# EAGLE design PCB-BI8-1x12SC3 (EAGLE 7.5.0)
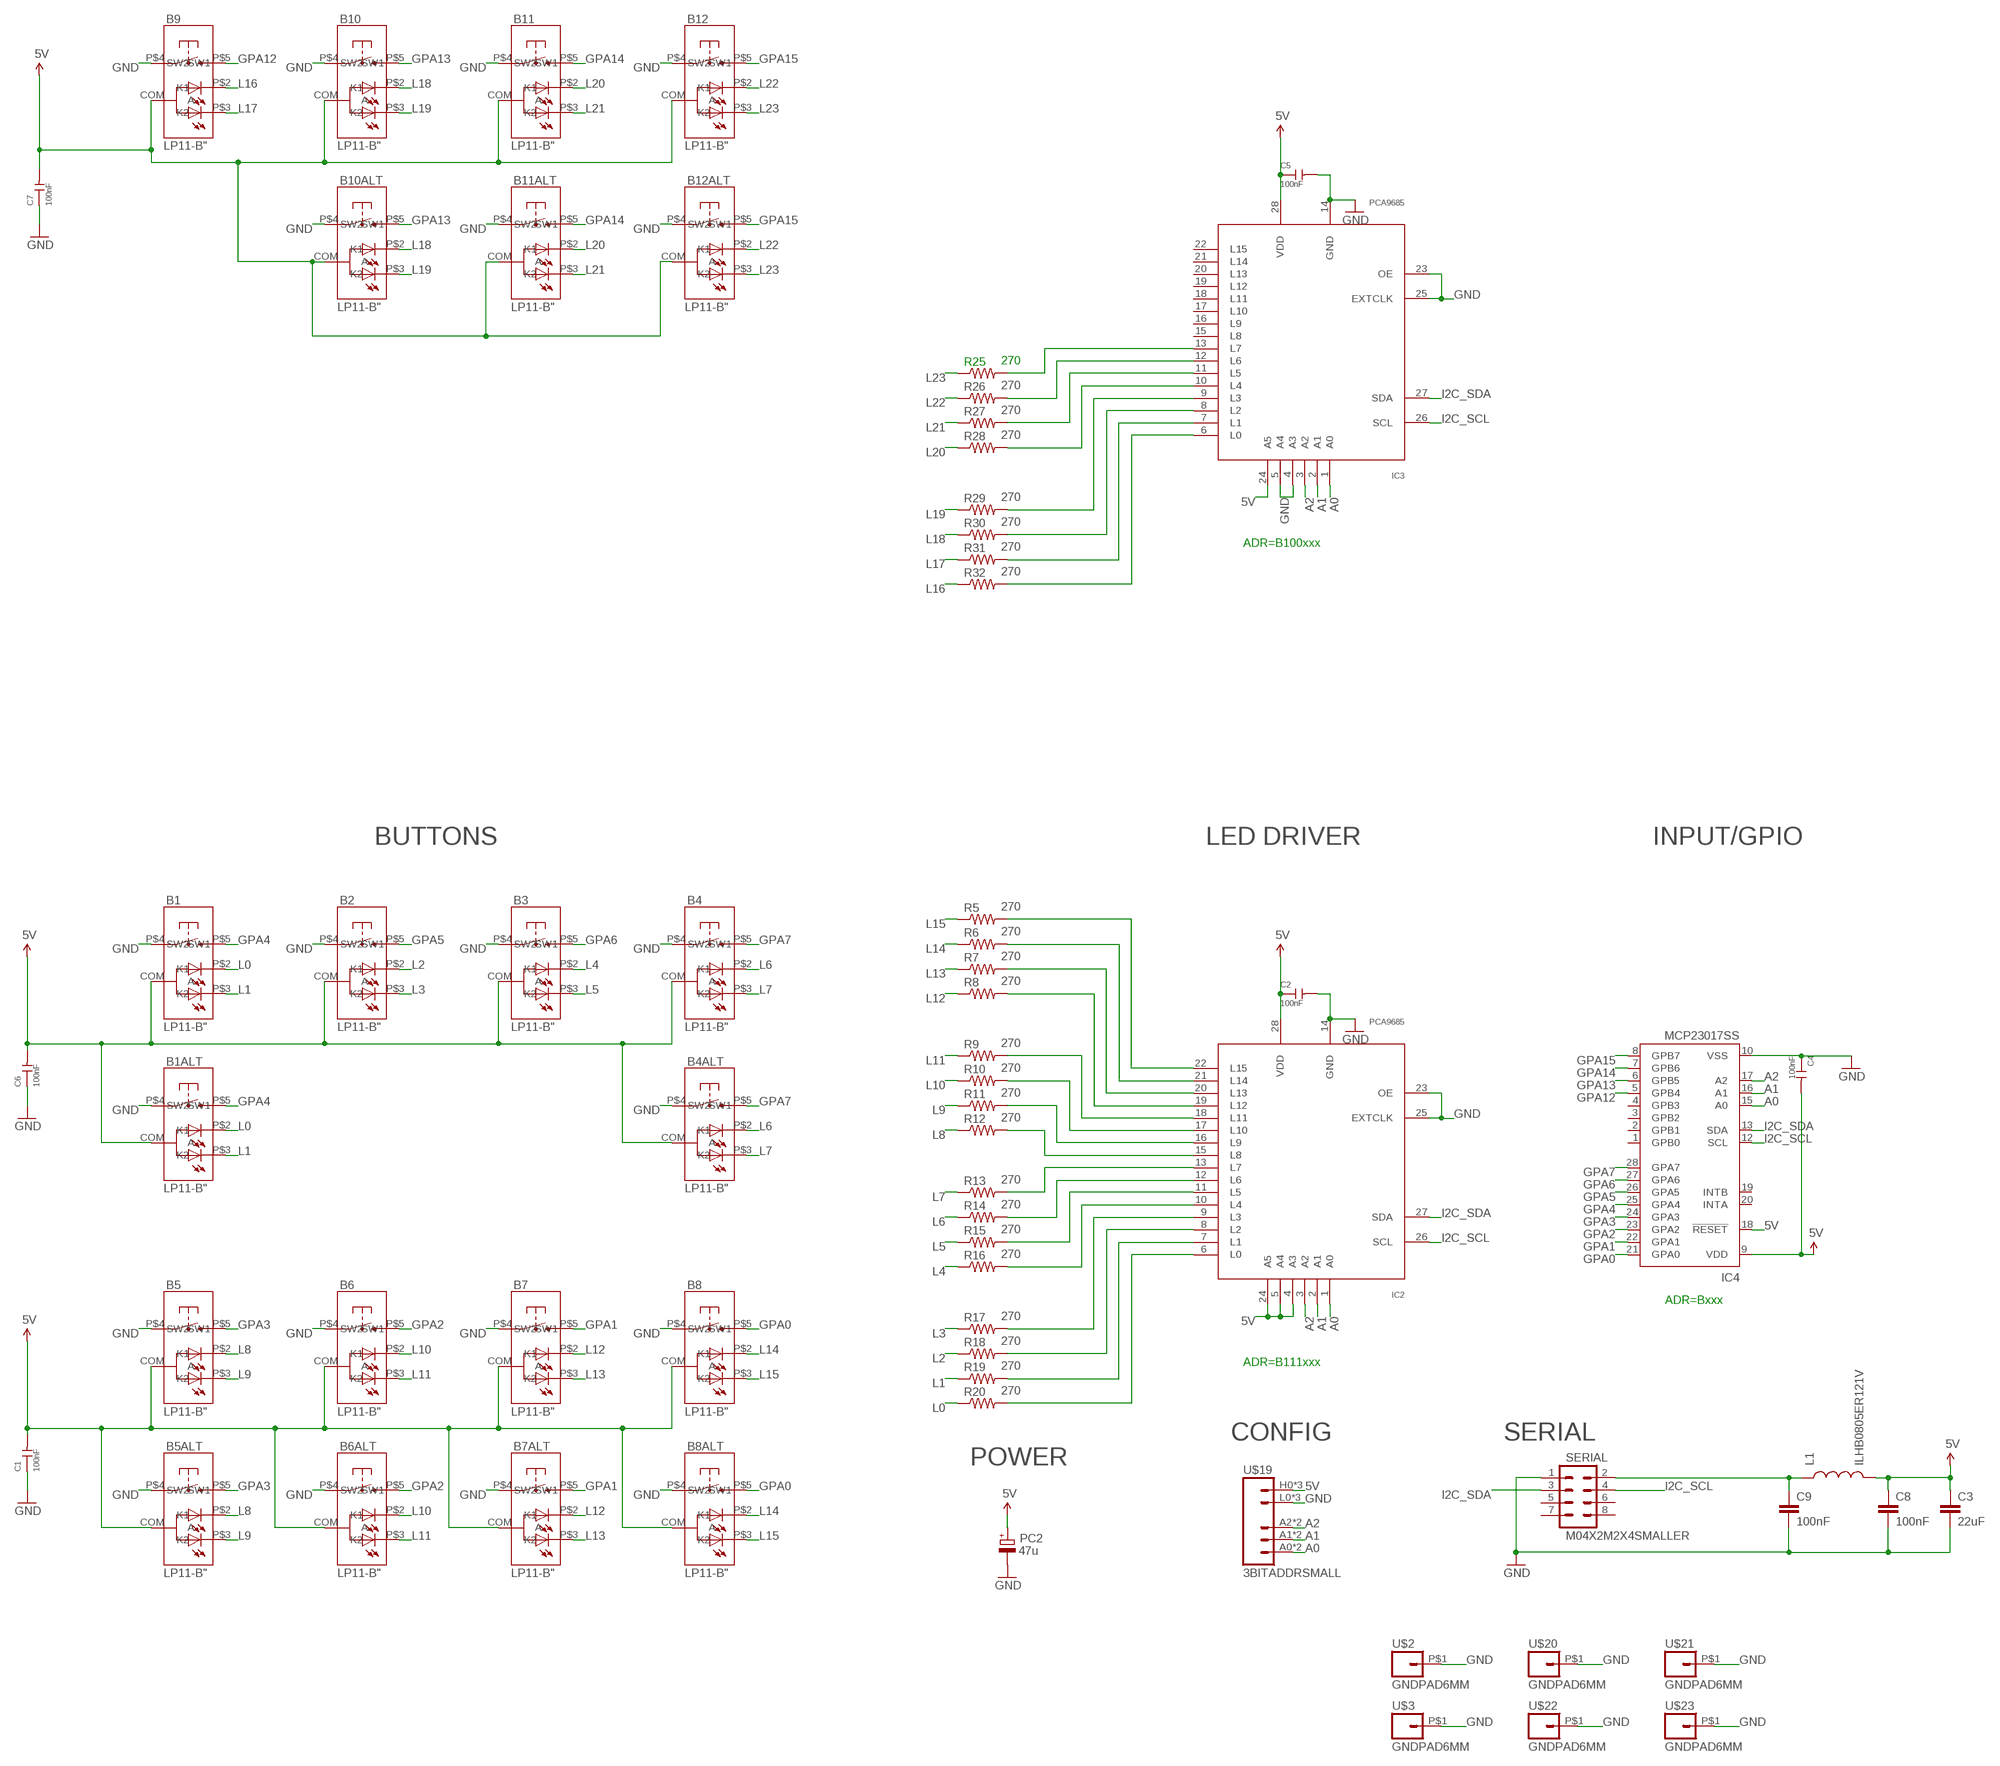
[diagram p0: schematic, sheet 1]

## Parts
B1  LP11-B"  [LP11]
B1ALT  LP11-B"  [LP11]
B2  LP11-B"  [LP11]
B3  LP11-B"  [LP11]
B4  LP11-B"  [LP11]
B4ALT  LP11-B"  [LP11]
B5  LP11-B"  [LP11]
B5ALT  LP11-B"  [LP11]
B6  LP11-B"  [LP11]
B6ALT  LP11-B"  [LP11]
B7  LP11-B"  [LP11]
B7ALT  LP11-B"  [LP11]
B8  LP11-B"  [LP11]
B8ALT  LP11-B"  [LP11]
B9  LP11-B"  [LP11]
B10  LP11-B"  [LP11]
B10ALT  LP11-B"  [LP11]
B11  LP11-B"  [LP11]
B11ALT  LP11-B"  [LP11]
B12  LP11-B"  [LP11]
B12ALT  LP11-B"  [LP11]
C1  100nF  CAP-0603  [C0603]
C2  100nF  CAP-0603  [C0603]
C3  22uF  CAP0805  [0805]
C4  100nF  CAP-0603  [C0603]
C5  100nF  CAP-0603  [C0603]
C6  100nF  CAP-0603  [C0603]
C7  100nF  CAP-0603  [C0603]
C8  100nF  CAP0603-CAP  [0603-CAP]
C9  100nF  CAP0603-CAP  [0603-CAP]
IC2  PCA9685  [TSSOP28]
IC3  PCA9685  [TSSOP28]
IC4  MCP23017SS  [SSOP28]
L1  ILHB0805ER121V  INDUCTOR0805  [0805]
PC2  47u  CPOL-EUD  [PANASONIC_D]
R5  270  RESISTOR0603-RES  [0603-RES]
R6  270  RESISTOR0603-RES  [0603-RES]
R7  270  RESISTOR0603-RES  [0603-RES]
R8  270  RESISTOR0603-RES  [0603-RES]
R9  270  RESISTOR0603-RES  [0603-RES]
R10  270  RESISTOR0603-RES  [0603-RES]
R11  270  RESISTOR0603-RES  [0603-RES]
R12  270  RESISTOR0603-RES  [0603-RES]
R13  270  RESISTOR0603-RES  [0603-RES]
R14  270  RESISTOR0603-RES  [0603-RES]
R15  270  RESISTOR0603-RES  [0603-RES]
R16  270  RESISTOR0603-RES  [0603-RES]
R17  270  RESISTOR0603-RES  [0603-RES]
R18  270  RESISTOR0603-RES  [0603-RES]
R19  270  RESISTOR0603-RES  [0603-RES]
R20  270  RESISTOR0603-RES  [0603-RES]
R25  270  RESISTOR0603-RES  [0603-RES]
R26  270  RESISTOR0603-RES  [0603-RES]
R27  270  RESISTOR0603-RES  [0603-RES]
R28  270  RESISTOR0603-RES  [0603-RES]
R29  270  RESISTOR0603-RES  [0603-RES]
R30  270  RESISTOR0603-RES  [0603-RES]
R31  270  RESISTOR0603-RES  [0603-RES]
R32  270  RESISTOR0603-RES  [0603-RES]
SERIAL  M04X2M2X4SMALLER  [M2X4SMALLER]
U$2  GNDPAD6MM  [3.2MMPAD6MM]
U$3  GNDPAD6MM  [3.2MMPAD6MM]
U$19  3BITADDRSMALL  [3BITADDR_SMALL]
U$20  GNDPAD6MM  [3.2MMPAD6MM]
U$21  GNDPAD6MM  [3.2MMPAD6MM]
U$22  GNDPAD6MM  [3.2MMPAD6MM]
U$23  GNDPAD6MM  [3.2MMPAD6MM]

## Nets
5V [Power]: B1.COM(A) B1ALT.COM(A) B2.COM(A) B3.COM(A) B4.COM(A) B4ALT.COM(A) B5.COM(A) B5ALT.COM(A) B6.COM(A) B6ALT.COM(A) B7.COM(A) B7ALT.COM(A) B8.COM(A) B8ALT.COM(A) B9.COM(A) B10.COM(A) B10ALT.COM(A) B11.COM(A) B11ALT.COM(A) B12.COM(A) B12ALT.COM(A) C1.2 C2.1 C3.1 C4.2 C5.1 C6.2 C7.2 C8.1 IC2.4(A3) IC2.5(A4) IC2.24(A5) IC2.28(VDD) IC3.24(A5) IC3.28(VDD) IC4.9(VDD) IC4.18(!RESET) L1.2 PC2.+ U$19.H0(VCC) U$19.H1(VCC) U$19.H2(VCC)
A0: IC2.1(A0) IC3.1(A0) IC4.15(A0) U$19.A0 U$19.AS0(A0)
A1: IC2.2(A1) IC3.2(A1) IC4.16(A1) U$19.A1 U$19.AS1(A1)
A2: IC2.3(A2) IC3.3(A2) IC4.17(A2) U$19.A2 U$19.AS2(A2)
GND [Power]: B1.P$4(SW1) B1ALT.P$4(SW1) B2.P$4(SW1) B3.P$4(SW1) B4.P$4(SW1) B4ALT.P$4(SW1) B5.P$4(SW1) B5ALT.P$4(SW1) B6.P$4(SW1) B6ALT.P$4(SW1) B7.P$4(SW1) B7ALT.P$4(SW1) B8.P$4(SW1) B8ALT.P$4(SW1) B9.P$4(SW1) B10.P$4(SW1) B10ALT.P$4(SW1) B11.P$4(SW1) B11ALT.P$4(SW1) B12.P$4(SW1) B12ALT.P$4(SW1) C1.1 C2.2 C3.2 C4.1 C5.2 C6.1 C7.1 C8.2 C9.2 IC2.14(GND) IC2.23(OE) IC2.25(EXTCLK) IC3.4(A3) IC3.5(A4) IC3.14(GND) IC3.23(OE) IC3.25(EXTCLK) IC4.10(VSS) PC2.- SERIAL.1 U$2.P$1 U$3.P$1 U$19.L0(GND) U$19.L1(GND) U$19.L2(GND) U$20.P$1 U$21.P$1 U$22.P$1 U$23.P$1
GPA0: B8.P$5(SW2) B8ALT.P$5(SW2) IC4.21(GPA0)
GPA1: B7.P$5(SW2) B7ALT.P$5(SW2) IC4.22(GPA1)
GPA2: B6.P$5(SW2) B6ALT.P$5(SW2) IC4.23(GPA2)
GPA3: B5.P$5(SW2) B5ALT.P$5(SW2) IC4.24(GPA3)
GPA4: B1.P$5(SW2) B1ALT.P$5(SW2) IC4.25(GPA4)
GPA5: B2.P$5(SW2) IC4.26(GPA5)
GPA6: B3.P$5(SW2) IC4.27(GPA6)
GPA7: B4.P$5(SW2) B4ALT.P$5(SW2) IC4.28(GPA7)
GPA12: B9.P$5(SW2) IC4.5(GPB4)
GPA13: B10.P$5(SW2) B10ALT.P$5(SW2) IC4.6(GPB5)
GPA14: B11.P$5(SW2) B11ALT.P$5(SW2) IC4.7(GPB6)
GPA15: B12.P$5(SW2) B12ALT.P$5(SW2) IC4.8(GPB7)
I2C_SCL: IC2.26(SCL) IC3.26(SCL) IC4.12(SCL) SERIAL.4
I2C_SDA: IC2.27(SDA) IC3.27(SDA) IC4.13(SDA) SERIAL.3
L0: B1.P$2(K1) B1ALT.P$2(K1) R20.1
L1: B1.P$3(K2) B1ALT.P$3(K2) R19.1
L2: B2.P$2(K1) R18.1
L3: B2.P$3(K2) R17.1
L4: B3.P$2(K1) R16.1
L5: B3.P$3(K2) R15.1
L6: B4.P$2(K1) B4ALT.P$2(K1) R14.1
L7: B4.P$3(K2) B4ALT.P$3(K2) R13.1
L8: B5.P$2(K1) B5ALT.P$2(K1) R12.1
L9: B5.P$3(K2) B5ALT.P$3(K2) R11.1
L10: B6.P$2(K1) B6ALT.P$2(K1) R10.1
L11: B6.P$3(K2) B6ALT.P$3(K2) R9.1
L12: B7.P$2(K1) B7ALT.P$2(K1) R8.1
L13: B7.P$3(K2) B7ALT.P$3(K2) R7.1
L14: B8.P$2(K1) B8ALT.P$2(K1) R6.1
L15: B8.P$3(K2) B8ALT.P$3(K2) R5.1
L16: B9.P$2(K1) R32.1
L17: B9.P$3(K2) R31.1
L18: B10.P$2(K1) B10ALT.P$2(K1) R30.1
L19: B10.P$3(K2) B10ALT.P$3(K2) R29.1
L20: B11.P$2(K1) B11ALT.P$2(K1) R28.1
L21: B11.P$3(K2) B11ALT.P$3(K2) R27.1
L22: B12.P$2(K1) B12ALT.P$2(K1) R26.1
L23: B12.P$3(K2) B12ALT.P$3(K2) R25.1
N$1: IC3.13(L7) R25.2
N$2: IC3.12(L6) R26.2
N$3: IC3.11(L5) R27.2
N$4: IC2.13(L7) R13.2
N$5: IC2.12(L6) R14.2
N$6: IC3.10(L4) R28.2
N$7: IC2.11(L5) R15.2
N$8: IC3.9(L3) R29.2
N$9: IC2.10(L4) R16.2
N$10: IC2.9(L3) R17.2
N$11: IC2.8(L2) R18.2
N$12: IC2.7(L1) R19.2
N$13: IC3.8(L2) R30.2
N$14: IC3.7(L1) R31.2
N$15: IC3.6(L0) R32.2
N$16 [Power]: C9.1 L1.1 SERIAL.2
N$19: IC2.6(L0) R20.2
N$20: IC2.15(L8) R12.2
N$21: IC2.16(L9) R11.2
N$22: IC2.17(L10) R10.2
N$23: IC2.18(L11) R9.2
N$24: IC2.19(L12) R8.2
N$25: IC2.20(L13) R7.2
N$26: IC2.21(L14) R6.2
N$27: IC2.22(L15) R5.2
Unconnected: IC3.15(L8) IC3.16(L9) IC3.17(L10) IC3.18(L11) IC3.19(L12) IC3.20(L13) IC3.21(L14) IC3.22(L15) IC4.1(GPB0) IC4.2(GPB1) IC4.3(GPB2) IC4.4(GPB3) IC4.19(INTB) IC4.20(INTA) SERIAL.5 SERIAL.6 SERIAL.7 SERIAL.8

## Notes on the sheet
- ADR=B100xxx
- BUTTONS | LED DRIVER | INPUT/GPIO
- ADR=Bxxx
- ADR=B111xxx
- CONFIG | SERIAL
- POWER

## Library data of the parts
B1 B1ALT B2-B4 B4ALT B5 B5ALT B6 B6ALT B7 B7ALT B8 B8ALT B9 B10 B10ALT B11 B11ALT B12 B12ALT = SKAARHOJ:LP11-B
C1 C2 C4-C7 = OPL:CAP: Ceramic Capacitors
C3 C8 C9 = SparkFun:CAP: Capacitor Standard 0603 ceramic capacitor, and 0.1" leaded capacitor.
IC2 IC3 = wsmith:PCA9685
IC4 = microchip:MCP23017: http://ww1.microchip.com/downloads/en/DeviceDoc/21952a.pdf Source: http://ww1.microchip.com/downloads/en/DeviceDoc/21952a.pdf; MF: MICROCHIP; MPN: MCP23017-E/SS; OC_FARNELL: 1467674; OC_NEWARK: 31K2960
L1 = SparkFun:INDUCTOR: Inductors Basic Inductor/Choke - 0603 and 1206. Footprints are not proven and vary greatly between part numbers.
PC2 = rcl:CPOL-EU: POLARIZED CAPACITOR, European symbol
R5-R20 R25-R32 = SparkFun-Passives:RESISTOR: Resistor Basic schematic elements and footprints for 0603, 1206, and PTH resistors.
SERIAL = SKAARHOJ:M04X2
U$2 U$3 U$20-U$23 = SKAARHOJ:GNDPAD
U$19 = SKAARHOJ:3BITADDR

## Net classes
0 default: width 0.152 mm, drill 0.406 mm, clearance 0.152 mm
1 Power: width 0.406 mm, drill 0.61 mm, clearance 0.152 mm

## Board
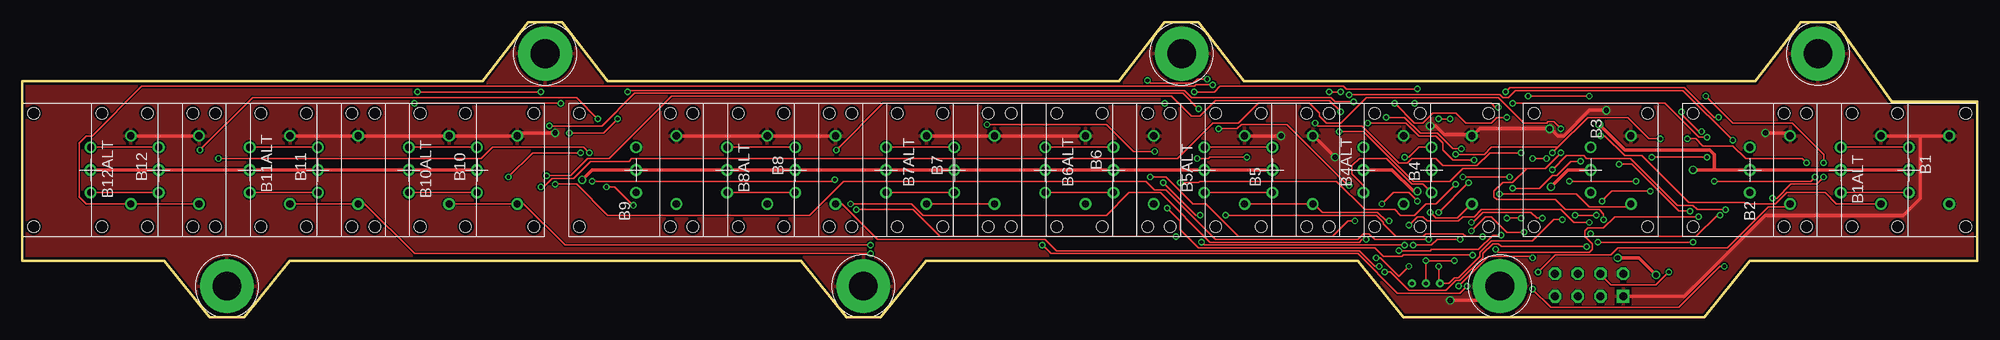
[diagram p1: board, top side]
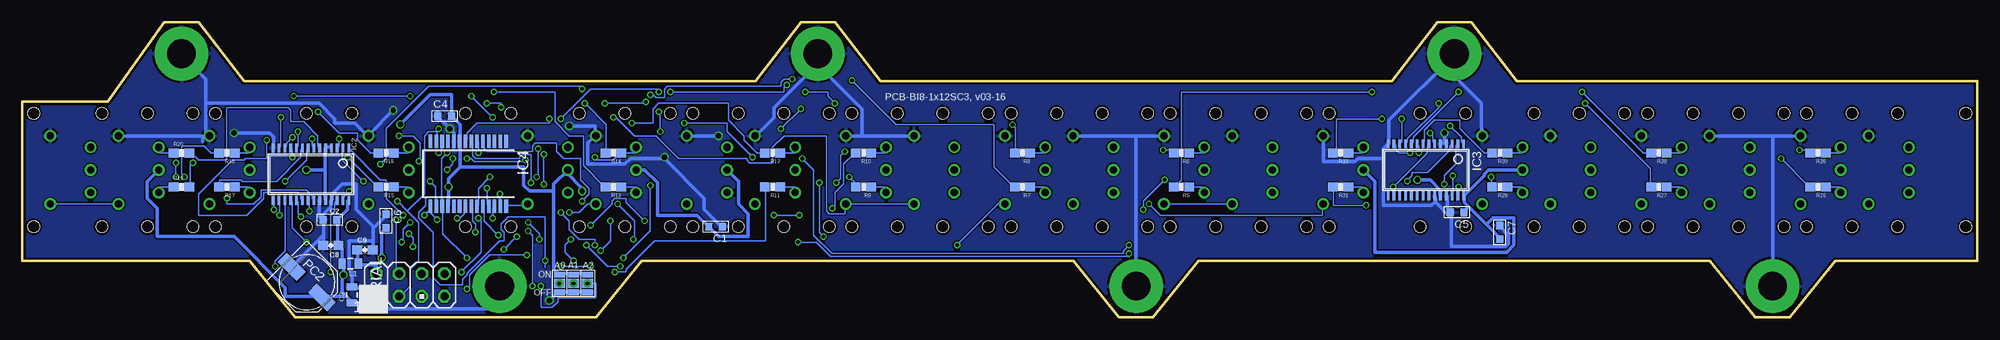
[diagram p2: board, bottom side, seen from below]

Size 218.44 x 33.02 mm. Coordinates in mm from the lower left corner, seen from the top.
Outline: 0,26.42 51.44,26.42 56.52,33.02 60.33,33.02 65.41,26.42 122.56,26.42 127.64,33.02 131.44,33.02 136.53,26.42 193.68,26.42 198.75,33.02 202.56,33.02 208.91,24.13 218.44,24.13 218.44,6.35 193.04,6.35 187.96,0 154.31,0 149.22,6.35 100.97,6.35 95.89,0 92.08,0 87,6.35 29.84,6.35 24.77,0 20.95,0 15.88,6.35 0,6.35 0,26.42
Copper layers (1*16): Top 0.035mm / dielectric 1.5mm / Bottom 0.035mm
Design rules "Fusion_eagle_rule_v1.1": minimum track width 6mil, minimum drill 12mil, track to track 6mil, track to pad 6mil, pad to pad 6mil, via to via 6mil, smd to smd 0mil, copper to edge 10mil, drill to drill 10mil, minimum pad ring 10mil, minimum via ring 6mil, stop-mask expansion 2mil, vias tented up to drill 100mil, thermal gap 10mil

### Footprints (pad centres in the part's own frame; a part is rotated, then mirrored left to right if it is on the bottom)
LP11 = drill 0.8: COM 0,0; P$2 0,2.54; P$3 0,-2.54; P$4 4.5,3.81; P$5 4.5,-3.81 | hole 1.3: -6.35,6.35; 6.35,6.35; 6.35,-6.35; -6.35,-6.35
C0603 = smd 0.889 x 0.889: 1 -0.762,0; 2 0.762,0
0805 = smd 0.8 x 1.2: 1 -0.9,0; 2 0.9,0
0603-CAP = smd 1.1 x 1: 1 -0.85,0; 2 0.85,0
TSSOP28 = smd 0.305 x 0.991: 1 -4.225,-2.918; 2 -3.575,-2.918; 3 -2.925,-2.918; 4 -2.275,-2.918; 5 -1.625,-2.918; 6 -0.975,-2.918; 7 -0.325,-2.918; 8 0.325,-2.918; 9 0.975,-2.918; 10 1.625,-2.918; 11 2.275,-2.918; 12 2.925,-2.918; 13 3.575,-2.918; 14 4.225,-2.918; 15 4.225,2.918; 16 3.575,2.918; 17 2.925,2.918; 18 2.275,2.918; 19 1.625,2.918; 20 0.975,2.918; 21 0.325,2.918; 22 -0.325,2.918; 23 -0.975,2.918; 24 -1.625,2.918; 25 -2.275,2.918; 26 -2.925,2.918; 27 -3.575,2.918; 28 -4.225,2.918
SSOP28 = smd 0.4 x 1.5: 1 -4.225,-3.625; 2 -3.575,-3.625; 3 -2.925,-3.625; 4 -2.275,-3.625; 5 -1.625,-3.625; 6 -0.975,-3.625; 7 -0.325,-3.625; 8 0.325,-3.625; 9 0.975,-3.625; 10 1.625,-3.625; 11 2.275,-3.625; 12 2.925,-3.625; 13 3.575,-3.625; 14 4.225,-3.625; 15 4.225,3.625; 16 3.575,3.625; 17 2.925,3.625; 18 2.275,3.625; 19 1.625,3.625; 20 0.975,3.625; 21 0.325,3.625; 22 -0.325,3.625; 23 -0.975,3.625; 24 -1.625,3.625; 25 -2.275,3.625; 26 -2.925,3.625; 27 -3.575,3.625; 28 -4.225,3.625
PANASONIC_D = smd 3 x 1.4: + 2.4,0; - -2.4,0
0603-RES = smd 1.1 x 1: 1 -0.85,0; 2 0.85,0
M2X4SMALLER = drill 0.9 square: 1 -1.27,3.81 | drill 0.9 octagon: 2 1.27,3.81; 3 -1.27,1.27; 4 1.27,1.27; 5 -1.27,-1.27; 6 1.27,-1.27; 7 -1.27,-3.81; 8 1.27,-3.81
3.2MMPAD6MM = drill 3.2 pad 6: P$1 0,0
3BITADDR_SMALL = drill 0.4: A0 -1.565,0; A1 0,0; A2 1.565,0 | smd 1.27 x 1: AS0 -1.565,0; AS1 0,0; AS2 1.565,0 | smd 1.27 x 0.635: H0 -1.565,1; H1 0,1; H2 1.565,1; L0 -1.565,-1; L1 0,-1; L2 1.565,-1

### Placement (x,y rotation side)
B1  210.82,16.51 0 top
B1ALT  203.2,16.51 0 top
B2  193.04,16.51 0 top
B3  175.26,16.51 0 top
B4  157.48,16.51 0 top
B4ALT  149.86,16.51 0 top
B5  139.7,16.51 0 top
B5ALT  132.08,16.51 0 top
B6  121.92,16.51 0 top
B6ALT  114.3,16.51 0 top
B7  104.14,16.51 0 top
B7ALT  96.52,16.51 0 top
B8  86.36,16.51 0 top
B8ALT  78.74,16.51 0 top
B9  68.58,16.51 0 top
B10  50.8,16.51 0 top
B10ALT  43.18,16.51 0 top
B11  33.02,16.51 0 top
B11ALT  25.4,16.51 0 top
B12  15.24,16.51 0 top
B12ALT  7.62,16.51 0 top
C1  140.97,10.16 180 bottom
C2  184.07,10.92 180 bottom
C3  181.61,2.54 90 bottom
C4  171.25,22.53 0 bottom
C5  58.12,11.76 180 bottom
C6  177.8,10.79 270 bottom
C7  53.34,9.53 270 bottom
C8  183.97,8.05 180 bottom
C9  180.16,7.57 0 bottom
IC2  186.18,16.03 180 bottom
IC3  61.59,16.51 180 bottom
IC4  168.61,16.08 180 bottom
L1  181.79,6.02 180 bottom
PC2  186.66,3.96 315 bottom
R5  88.9,14.61 180 bottom
R6  88.9,18.41 180 bottom
R7  106.68,14.61 180 bottom
R8  106.68,18.41 180 bottom
R9  124.46,14.61 180 bottom
R10  124.46,18.41 180 bottom
R11  134.62,14.61 180 bottom
R12  134.62,18.41 180 bottom
R13  152.4,14.61 180 bottom
R14  152.4,18.41 180 bottom
R15  177.8,14.61 180 bottom
R16  177.8,18.41 180 bottom
R17  195.58,14.61 180 bottom
R18  195.58,18.41 180 bottom
R19  200.66,14.61 0 bottom
R20  200.66,18.41 0 bottom
R25  17.78,14.61 180 bottom
R26  17.78,18.41 180 bottom
R27  35.56,14.61 180 bottom
R28  35.56,18.41 180 bottom
R29  53.34,14.61 180 bottom
R30  53.34,18.41 180 bottom
R31  71.12,14.61 180 bottom
R32  71.12,18.41 180 bottom
SERIAL  175.08,3.63 90 bottom
U$2  22.86,3.5 0 top
U$3  58.42,29.52 0 top
U$19  156.84,3.81 0 bottom
U$20  93.98,3.5 0 top
U$21  165.1,3.5 0 top
U$22  200.66,29.52 0 top
U$23  129.54,29.52 0 top

### Tracks (layer width: path | path; a pad name or v marks a point on that pad's centre or on a via)
5V  (via drill 0.61)
  Top 0.406: B10.COM B10ALT.COM B11.COM B11ALT.COM B12.COM B12ALT.COM | v178.28,6.67 180.66,6.67 v182.56,4.76 | B1.COM B1ALT.COM B2.COM 189.07,16.51 | 189.07,16.51 v186.69,16.51 | B3.COM 172.72,16.51 v170.81,14.61 | v62.55,15.4 63.66,16.51 B9.COM B8ALT.COM B8.COM B7ALT.COM B7.COM B6ALT.COM B6.COM B5ALT.COM B5.COM | v155.89,14.13 155.42,14.13 153.03,16.51 B4ALT.COM | 189.07,16.51 189.07,18.26 188.59,18.73 179.07,18.73 v176.21,21.59
  Bottom 0.406: 56.91,12.46 57.31,12.86 57.31,13.49 IC3.28 57.31,13.65 55.09,15.88 55.09,16.03 54.61,16.51 B10.COM | 56.91,12.46 54.85,10.4 | 54.85,10.4 53.34,8.89 C7.2 | C5.1 57.31,11.91 56.99,12.22 56.99,12.38 56.91,12.46 | IC2.28 182.09,13.02 182.09,12.06 183.2,10.95 C2.1 183.2,10.79 183.2,8.1 C8.1 183.04,7.94 182.72,7.62 182.72,6.19 L1.2 182.56,5.87 v182.56,4.76 182.72,4.76 182.72,2.86 182.32,2.46 | v178.28,6.67 178.28,9.53 177.8,10 C6.2 | 182.32,2.46 181.61,1.75 C3.1 | 182.32,2.46 182.4,2.38 184.94,2.38 PC2.+ 185.1,2.38 189.07,2.38 189.07,3.33 194.79,9.05 203.36,9.05 203.36,12.22 204.47,13.34 204.47,15.24 B1ALT.COM | 184.63,16.51 184.63,18.89 IC2.5 184.47,19.05 183.99,19.05 IC2.4 | 184.63,16.51 184.63,13.18 IC2.24 | v186.69,16.51 184.63,16.51 | 169.54,16.83 170.81,15.56 v170.81,14.61 170.81,12.54 IC4.18 | 169.54,16.83 169.54,19.53 IC4.9 169.54,19.84 169.54,21.59 C4.2 170.5,22.7 170.5,24.92 172.88,24.92 v176.21,21.59 | 159.07,14.13 159.07,14.92 B4.COM 157.64,16.19 155.89,14.45 v155.89,14.13 | 169.54,16.83 162.4,16.83 162.4,14.76 161.77,14.13 159.07,14.13 | v62.55,15.4 61.12,15.4 60.01,14.29 60.01,13.65 IC3.24 | B4ALT.COM 148.91,16.51 147.48,15.08 147.48,11.43 143.03,11.43 141.76,10.16 C1.2 141.6,10 140.65,9.05 137.32,9.05 137.32,11.59 138.43,12.7 138.43,15.24 B5.COM | 54.85,10.4 54.13,11.11 51.75,11.11 51.75,8.1 52.55,7.3 67.31,7.3 67.31,15.24 B9.COM | U$19.H2 155.42,4.92 156.84,4.92 U$19.H1 157,4.92 158.27,4.92 U$19.H0 158.59,4.92 159.07,5.4 159.07,14.13
A0  (via drill 0.41)
  Top 0.152: v173.51,11.43 v175.9,11.43 | v58.9,21.43 64.77,21.43 68.42,25.08 129.7,25.08 v131.44,23.34 | v133.67,21.11 135.73,21.11 136.21,21.59 141.29,21.59 148.11,14.76 v148.27,14.76 | v151.29,6.67 151.76,6.67 153.83,4.6 v154.94,5.71 | v172.09,10.95 171.13,10.95 168.75,8.57 164.15,8.57 162.88,7.3 162.88,6.83 160.5,4.45 160.02,4.45 159.38,3.81 U$19.AS0 158.27,3.81 v158.27,5.71
  Bottom 0.152: v175.9,11.43 177.8,13.34 177.8,15.4 178.44,15.4 181.93,18.89 IC2.1 | 173.04,11.91 172.88,12.06 172.88,12.38 IC4.15 | 173.04,11.91 v173.51,11.43 | v58.9,21.43 57.63,20.16 57.63,19.68 57.47,19.53 IC3.1 | v133.67,21.11 v131.44,23.34 | v148.27,14.76 148.27,9.68 v151.29,6.67 | v172.09,10.95 173.04,11.91 | 158.43,3.81 U$19.AS0 | v154.94,5.71 v158.27,5.71
A1  (via drill 0.41)
  Top 0.152: v172.88,15.24 v180.34,15.24 | v59.53,14.92 61.91,14.92 65.41,11.43 87.95,11.43 91.76,15.24 125.57,15.24 126.52,14.29 127.79,14.29 133.35,8.73 149.22,8.73 149.86,9.37 150.5,9.37 151.13,8.73 v157.16,8.73 | U$19.AS1 v156.84,6.35 v160.02,6.35
  Bottom 0.152: v180.34,15.24 182.72,17.62 182.72,18.89 IC2.2 | v172.88,15.24 172.24,14.61 172.24,13.49 | 172.24,13.49 172.24,12.54 IC4.16 | v59.53,14.92 59.53,15.88 58.26,17.14 58.26,19.21 58.1,19.37 IC3.2 | v157.16,8.73 157.8,8.1 157.8,7.3 v156.84,6.35 | 172.24,13.49 173.35,13.49 173.35,12.54 174.15,11.75 174.15,11.11 172.56,9.53 172.56,4.45 171.77,3.65 169.23,3.65 169.23,4.29 168.75,4.76 168.75,4.92 165.1,8.57 164.62,8.57 164.62,9.53 164.94,9.84 164.94,10.48 164.15,11.27 160.02,11.27 v160.02,6.35 160.02,5.56
A2  (via drill 0.41)
  Top 0.152: v183.04,20 181.77,20 179.39,22.38 174.94,22.38 171.61,19.05 | v170.97,18.41 171.61,19.05 | v63.66,15.24 90.65,15.24 v90.81,15.4 | v93.19,12.06 99.54,12.06 102.55,9.05 v128.91,9.05 | v129.38,15.08 131.44,15.08 131.6,15.24 146.84,15.24 150.02,12.06 153.35,12.06 153.99,11.43 155.57,11.43 156.84,12.7 157.96,12.7 v160.18,14.92 | v160.18,18.26 163.35,18.26 164.15,19.05 171.61,19.05 | v160.5,3.49 163.83,6.83 168.59,6.83 v168.75,6.67
  Bottom 0.152: v183.04,20 183.04,19.21 183.2,19.05 IC2.3 | v170.97,18.41 171.61,17.78 171.61,12.54 IC4.17 171.45,12.38 171.45,9.37 v168.75,6.67 | v63.66,15.24 63.66,15.4 63.18,15.88 63.18,16.19 61.44,16.19 58.9,18.73 58.9,19.21 58.74,19.37 IC3.3 | v90.81,15.4 93.19,13.02 v93.19,12.06 | v128.91,9.05 129.38,9.53 v129.38,15.08 | v160.18,18.26 v160.18,14.92 | 155.42,3.81 U$19.AS2 154.31,3.81 154.31,2.38 154.46,2.22 158.59,2.22 158.59,1.75 159.23,1.11 160.5,1.11 v160.5,3.49
GND  (via drill 0.61)
  Top 0.406: B1.P$4 212.09,20.32 | 212.09,20.32 B1ALT.P$4 | v194.79,20.64 197.17,20.64 197.49,20.32 B2.P$4 | 212.09,20.32 212.09,13.34 210.19,11.43 194.79,11.43 185.74,2.38 178.91,2.38 SERIAL.1 | v59.53,20.64 55.72,20.64 55.4,20.32 B10.P$4 B10ALT.P$4 B11.P$4 B11ALT.P$4 | B12.P$4 B12ALT.P$4 | v146.69,17.94 144.3,20.32 B5.P$4 | v157.32,21.43 157.96,21.43 158.91,20.48 161.93,20.48 B4.P$4 162.08,20.32 162.88,21.11 v170.66,21.11 170.81,21.11 171.61,20.32 172.24,20.32 175.1,23.18 v177.01,23.18 | B7ALT.P$4 B7.P$4 B6ALT.P$4 | B9.P$4 B8ALT.P$4 B8.P$4 | B5ALT.P$4 v140.65,20.32 | v159.54,1.91 163.51,1.91 U$21.P$1
  Bottom 0.406: C2.2 184.94,10.95 185.26,11.27 185.26,13.02 IC2.23 | C2.2 185.1,11.27 183.99,12.38 183.99,13.02 IC2.25 183.83,13.18 183.83,13.81 182.72,14.92 181.13,14.92 181.13,12.06 179.15,10.08 | 184.78,9.05 184.78,10.79 C2.2 | 184.78,9.05 184.78,8.1 C8.2 | PC2.- 188.28,5.71 184.94,9.05 184.78,9.05 | 179.15,10.08 179.23,10 179.23,8.57 | 179.15,10.08 177.8,11.43 C6.1 | 179.23,8.57 179.23,7.62 C9.2 | 179.23,8.57 181.93,8.57 181.93,5.4 181.61,5.08 C3.2 181.61,3.33 178.91,3.33 178.91,2.38 SERIAL.1 177.48,0.95 165.1,0.95 U$21.P$1 165.1,1.91 | v194.79,20.64 190.82,20.64 190.34,20.16 190.34,19.05 IC2.14 | 197.96,23.97 185.26,23.97 183.51,22.23 183.51,21.75 181.29,21.75 179.86,20.32 B3.P$4 179.71,20.48 v177.01,23.18 | 197.96,23.97 197.96,20.64 197.64,20.32 B2.P$4 198.28,20.32 | 198.28,20.32 B1ALT.P$4 | 197.96,23.97 197.96,26.67 200.66,29.37 U$22.P$1 | 58.74,11.27 58.74,11.75 C5.2 58.9,11.91 59.21,12.22 59.21,13.49 IC3.25 | 58.74,11.27 58.74,7.94 52.7,7.94 52.39,8.26 52.39,9.21 53.34,10.16 C7.1 | 60.48,12.86 60.48,13.34 60.64,13.49 IC3.23 | 60.48,12.86 58.9,11.27 58.74,11.27 | 66.36,17.78 66.36,18.89 65.88,19.37 IC3.14 65.72,19.53 65.72,22.07 58.42,29.37 U$3.P$1 59.53,28.1 55.4,23.97 55.4,20.32 B10.P$4 | 66.36,17.78 66.36,12.54 60.96,12.54 60.64,12.86 60.48,12.86 | 59.53,19.53 59.85,19.53 IC3.5 | 59.53,19.53 59.37,19.53 IC3.4 | v59.53,20.64 59.53,19.53 | B11ALT.P$4 22.86,20.32 | 22.86,20.32 B12.P$4 | 22.86,20.32 U$2.P$1 | C4.1 171.93,22.38 v170.66,21.11 170.18,20.64 170.18,19.84 IC4.10 | 146.69,17.78 142.24,13.34 142.24,12.06 140.34,10.16 C1.1 | 146.69,17.78 150.5,17.78 151.13,17.14 155.26,17.14 155.26,19.53 154.46,20.32 B4ALT.P$4 154.46,20.48 154.46,21.43 v157.32,21.43
  Bottom 0.406: v146.69,17.94 146.69,17.78 | B5ALT.P$4 136.53,20.32 134.46,22.38 134.46,23.5 129.54,28.42 U$23.P$1 129.54,28.26 124.62,23.34 124.62,20.32 | B6.P$4 124.62,20.32 | 124.62,20.32 B6ALT.P$4 | B8.P$4 93.98,20.32 | 93.98,20.32 B7ALT.P$4 | 93.98,20.32 U$20.P$1 | v140.65,20.32 B5.P$4 | 66.36,17.78 69.22,17.78 69.53,17.46 73.03,17.46 73.03,20.32 B9.P$4 | 198.31,19.66 198.28,19.68 198.28,20.32 | U$19.L2 155.42,2.86 156.84,2.86 U$19.L1 157,2.86 158.27,2.86 U$19.L0 158.59,2.86 v159.54,1.91
  pour Top: 0,0 218.44,0 218.44,34.29 0,34.29
  pour Bottom: 0,0 218.44,0 218.44,33.66 0,33.66
GPA0  (via drill 0.41)
  Top 0.152: v169.86,11.11 169.23,11.11 168.59,11.75 163.19,11.75 162.08,10.64 v161.93,10.64 | v160.66,8.73 158.12,8.73 157.48,8.1 v155.42,8.1 | v151.61,5.71 151.13,5.71 149.38,7.46 115.57,7.46 114.3,8.73 95.57,8.73 91.6,12.7 B8.P$5
  Bottom 0.152: v169.86,11.11 169.54,11.11 169.07,11.59 169.07,12.38 IC4.21 | v161.93,10.64 160.66,9.37 v160.66,8.73 | v155.42,8.1 153.03,5.71 v151.61,5.71 | B8.P$5 B8ALT.P$5
GPA1  (via drill 0.41)
  Top 0.152: v167.8,9.53 165.89,9.53 164.15,11.27 163.51,11.27 v161.93,9.68 | v161.45,3.49 160.66,2.7 153.67,2.7 149.22,7.14 114.94,7.14 v113.98,8.1 | B7.P$5 B7ALT.P$5
  Bottom 0.152: v167.8,9.53 167.8,10.48 168.12,10.79 168.12,12.22 168.28,12.38 IC4.22 | v161.93,9.68 161.45,9.21 v161.45,3.49 | v113.98,8.1 109.06,13.02 108.74,13.02 108.74,12.7 B7.P$5
GPA2  (via drill 0.41)
  Top 0.152: v160.97,15.72 v166.21,15.72 | v160.81,18.89 159.86,18.89 158.12,20.64 156.21,20.64 154.46,22.38 v152.4,22.38
  Bottom 0.152: v166.21,15.72 167.48,14.45 167.48,12.54 IC4.23 | v160.97,15.72 160.81,15.88 v160.81,18.89 | v152.4,22.38 152.08,22.38 150.02,20.32 147.64,20.32 145.1,17.78 137.48,17.78 137.48,17.62 137.16,17.3 134.62,17.3 134.62,19.05 133.35,20.32 128.59,20.32 128.59,11.91 128.27,11.59 126.52,11.59 126.52,12.7 B6.P$5 B6ALT.P$5
GPA3  (via drill 0.41)
  Top 0.152: v165.26,9.21 164.31,9.21 162.72,7.62 157.48,7.62 157.32,7.46 v153.83,7.46 | v152.72,10.79 152.4,10.79 151.45,11.75 145.26,11.75 144.3,12.7 B5.P$5 B5ALT.P$5
  Bottom 0.152: v165.26,9.21 166.85,10.79 166.85,12.38 IC4.24 | v153.83,7.46 152.72,8.57 v152.72,10.79
GPA4  (via drill 0.41)
  Top 0.152: v166.53,14.45 169.54,14.45 170.97,15.88 171.45,15.88 173.04,17.46 v174.15,17.46 | v176.37,20.32 176.85,20.32 179.07,18.1 180.97,18.1 186.21,12.86 192.41,12.86 192.56,12.7 195.9,12.7 197.17,13.97 201.45,13.97 202.72,12.7 B1ALT.P$5
  Bottom 0.152: v166.53,14.45 166.53,12.7 166.37,12.54 IC4.25 | v174.15,17.46 173.99,17.62 173.99,19.53 174.78,20.32 v176.37,20.32 | B1ALT.P$5 B1.P$5
GPA5  (via drill 0.41)
  Top 0.152: v167.48,11.11 v165.89,11.11 | v169.39,5.08 171.29,6.99 177.48,6.99 178.28,7.78 190.5,7.78 195.1,12.38 197.17,12.38 197.49,12.7 B2.P$5
  Bottom 0.152: v165.89,11.11 165.89,12.22 165.74,12.38 IC4.26 | v167.48,11.11 167.16,10.79 167.16,7.3 v169.39,5.08
GPA6  (via drill 0.41)
  Top 0.152: v165.1,13.81 173.67,13.81 175.1,12.38 179.39,12.38 179.71,12.7 B3.P$5
  Bottom 0.152: v165.1,13.81 165.1,12.54 IC4.27
GPA7  (via drill 0.41)
  Top 0.152: v157.32,11.75 157.96,11.11 160.34,11.11 161.93,12.7 B4.P$5
  Bottom 0.152: IC4.28 164.31,12.54 162.08,12.54 162.08,12.7 B4.P$5 | B4ALT.P$5 155.26,12.7 156.21,11.75 v157.32,11.75
GPA12  (via drill 0.41)
  Top 0.152: v155.89,13.02 154.94,13.97 153.19,13.97 v151.92,12.7 | v150.18,8.73 149.7,8.73 149.38,8.41 132.72,8.41 127.16,13.97 123.67,13.97 121.13,11.43 100.65,11.43 99.38,12.7 v92.55,12.7
  Bottom 0.152: v155.89,13.02 155.1,13.81 155.1,14.45 156.05,15.4 156.05,17.78 157.96,17.78 158.75,18.57 158.75,19.53 161.13,19.53 161.45,19.21 161.45,18.57 166.53,18.57 166.85,18.89 166.85,19.68 IC4.5 | v151.92,12.7 150.02,10.79 150.02,8.89 v150.18,8.73 | v92.55,12.7 91.28,11.43 73.18,11.43 73.18,12.7 B9.P$5
GPA13  (via drill 0.41)
  Top 0.152: v167.48,18.41 163.99,18.41 162.56,16.99 158.75,16.99 157.96,17.78 155.26,17.78 154.78,17.3 153.83,17.3 149.7,21.43 144.78,21.43 v144.46,21.75 | v136.84,17.94 132.72,17.94 132.56,17.78 v131.29,17.78 | v94.77,8.1 60.64,8.1 56.04,12.7 B10.P$5 B10ALT.P$5
  Bottom 0.152: v167.48,18.41 167.48,19.68 IC4.6 | v144.46,21.75 139.7,21.75 139.7,20.8 v136.84,17.94 | v131.29,17.78 130.02,16.51 130.02,9.21 127.95,7.14 95.41,7.14 95.41,7.46 v94.77,8.1
GPA14  (via drill 0.41)
  Top 0.152: v158.27,11.75 v161.61,15.08 | v154.46,8.1 132.08,8.1 v131.76,8.41 | v94.77,7.14 43.81,7.14 38.26,12.7 B11.P$5 B11ALT.P$5
  Bottom 0.152: v161.61,15.08 161.61,18.26 162.56,18.26 162.88,17.94 162.88,17.78 167.8,17.78 168.12,18.1 168.12,19.53 168.28,19.68 IC4.7 | v158.27,11.75 157.32,10.79 157.32,9.84 156.21,8.73 154.46,8.73 v154.46,8.1 | v131.76,8.41 129.7,8.41 128.11,6.83 94.77,6.83 v94.77,7.14
GPA15  (via drill 0.41)
  Top 0.152: v158.27,22.23 v159.54,22.23 | v146.05,25.24 v147.32,25.24 | v133.03,26.04 131.13,26.04 130.97,25.88 13.34,25.88 7.78,20.32 7.14,20.32 6.35,19.53 6.35,13.49 7.14,12.7 B12ALT.P$5 B12.P$5
  Bottom 0.152: v159.54,22.23 159.54,21.75 167.64,21.75 168.75,20.64 168.75,20 168.91,19.84 IC4.8 | v158.27,22.23 154.94,25.56 147.32,25.56 v147.32,25.24 | v146.05,25.24 133.35,25.24 133.35,25.72 v133.03,26.04
I2C_SCL  (via drill 0.41)
  Top 0.152: v183.99,5.08 182.56,3.65 177.48,3.65 176.37,4.76 SERIAL.4 | v58.58,15.88 61.28,15.88 63.18,17.78 65.56,17.78 72.55,24.77 128.43,24.77 130.65,22.54 131.6,22.54 133.35,24.29 146.05,24.29 v147.32,23.02 | v147.16,20.8 149.86,20.8 155.42,15.24 159.54,15.24 160.97,16.67 168.12,16.67 | 168.12,16.67 170.18,16.67 v171.93,18.41 | v176.69,10.95 176.69,11.59 176.21,12.06 172.4,12.06 171.29,13.18 164.78,13.18 164.47,13.49 164.47,14.13 165.42,15.08 166.53,15.08 168.12,16.67
  Bottom 0.152: v183.99,5.08 183.99,11.43 183.51,11.91 183.51,12.86 183.36,13.02 IC2.26 | v58.58,15.88 58.58,13.65 IC3.26 | v147.32,23.02 147.16,22.86 v147.16,20.8 | v171.93,18.41 171.61,18.73 171.61,19.68 IC4.12 | SERIAL.4 176.69,5.24 v176.69,10.95
I2C_SDA  (via drill 0.41)
  Top 0.152: v181.93,14.13 177.64,14.13 v176.53,13.02 | v57.94,14.61 58.26,14.61 59.21,15.56 61.59,15.56 63.5,17.46 67.79,17.46 68.1,17.78 129.06,17.78 133.03,21.75 135.89,21.75 138.11,23.97 143.83,23.97 144.94,22.86 144.94,22.54 145.73,21.75 147.32,21.75 150.18,24.61 164.94,24.61 167.8,21.75 170.34,21.75 170.5,21.91 171.13,21.91 v171.93,21.11
  Bottom 0.152: v181.93,14.13 182.56,13.49 182.56,13.18 IC2.27 | 175.42,11.91 174.15,10.64 174.15,6.35 175.1,5.4 175.1,3.49 176.21,2.38 SERIAL.3 | 175.42,11.91 v176.53,13.02 | v57.94,14.61 57.94,13.65 IC3.27 | 172.09,20.8 172.09,19.84 IC4.13 | 172.09,20.8 172.09,20.95 v171.93,21.11 172.09,20.8 | 175.42,11.91 173.51,13.81 173.51,20.32 173.04,20.8 172.09,20.8
L0
  Top 0.152: B1.P$2 B1ALT.P$2
  Bottom 0.152: R20.1 203.2,18.41 B1ALT.P$2
L1
  Top 0.152: B1.P$3 B1ALT.P$3
  Bottom 0.152: R19.1 203.2,14.61 B1ALT.P$3
L2
  Bottom 0.152: R18.1 193.04,18.41 B2.P$2
L3
  Bottom 0.152: R17.1 193.04,14.61 B2.P$3
L4
  Bottom 0.152: R16.1 175.26,18.41 B3.P$2
L5
  Bottom 0.152: R15.1 175.26,14.61 B3.P$3
L6  (via drill 0.41)
  Top 0.152: v154.46,17.94 154.94,17.94 156.05,19.05 B4.P$2
  Bottom 0.152: B4ALT.P$2 149.86,18.41 R14.1 151.61,18.41 152.4,17.62 154.46,17.62 v154.46,17.94
L7
  Top 0.152: B4ALT.P$3 149.86,14.76 148.59,16.03 148.59,16.99 149.38,17.78 152.4,17.78 155.26,14.92 156.53,14.92 B4.P$3
  Bottom 0.152: R13.1 149.86,14.61 B4ALT.P$3
L8
  Top 0.152: B5.P$2 B5ALT.P$2
  Bottom 0.152: R12.1 132.08,18.41 B5ALT.P$2
L9
  Top 0.152: B5.P$3 B5ALT.P$3
  Bottom 0.152: R11.1 132.08,14.61 B5ALT.P$3
L10
  Top 0.152: B6.P$2 B6ALT.P$2
  Bottom 0.152: R10.1 121.92,18.41 B6.P$2
L11
  Top 0.152: B6.P$3 B6ALT.P$3
  Bottom 0.152: R9.1 121.92,14.61 B6.P$3
L12
  Top 0.152: B7.P$2 B7ALT.P$2
  Bottom 0.152: R8.1 104.14,18.41 B7.P$2
L13
  Top 0.152: B7.P$3 B7ALT.P$3
  Bottom 0.152: R7.1 104.14,14.61 B7.P$3
L14
  Top 0.152: B8.P$2 B8ALT.P$2
  Bottom 0.152: R6.1 86.36,18.41 B8.P$2
L15
  Top 0.152: B8.P$3 B8ALT.P$3
  Bottom 0.152: R5.1 86.36,14.61 B8.P$3
L16
  Bottom 0.152: R32.1 68.58,18.41 B9.P$2
L17
  Bottom 0.152: R31.1 68.58,14.61 B9.P$3
L18
  Top 0.152: B10.P$2 B10ALT.P$2
  Bottom 0.152: R30.1 50.8,18.41 B10.P$2
L19
  Top 0.152: B10.P$3 B10ALT.P$3
  Bottom 0.152: R29.1 50.8,14.61 B10.P$3
L20
  Top 0.152: B11.P$2 B11ALT.P$2
  Bottom 0.152: R28.1 33.02,18.41 B11.P$2
L21
  Top 0.152: B11.P$3 B11ALT.P$3
  Bottom 0.152: R27.1 33.02,14.61 B11.P$3
L22
  Top 0.152: B12.P$2 B12ALT.P$2
  Bottom 0.152: R26.1 15.24,18.41 B12.P$2
L23
  Top 0.152: B12.P$3 B12ALT.P$3
  Bottom 0.152: R25.1 15.24,14.61 B12.P$3
N$1  (via drill 0.41)
  Top 0.152: v63.34,18.41 62.71,19.05 52.55,19.05 51.28,17.78 v21.91,17.78
  Bottom 0.152: v63.34,18.41 64.61,18.41 64.93,18.73 64.93,19.21 65.09,19.37 IC3.13 | v21.91,17.78 18.73,14.61 R25.2
N$2  (via drill 0.41)
  Top 0.152: v64.29,22.23 61.91,24.61 25.72,24.61 v19.84,18.73
  Bottom 0.152: v64.29,22.23 64.29,19.68 64.45,19.53 IC3.12 | v19.84,18.73 18.73,18.73 18.73,18.41 R26.2
N$3  (via drill 0.41)
  Top 0.152: v43.81,23.97 v60.17,23.97
  Bottom 0.152: v60.17,23.97 60.17,23.5 63.66,20 63.66,19.68 63.82,19.53 IC3.11 | v43.81,23.97 36.51,16.67 36.51,14.61 R27.2
N$4  (via drill 0.41)
  Top 0.152: v189.55,22.38 189.07,22.38 185.74,25.72 166.21,25.72 v165.74,25.24
  Bottom 0.152: v189.55,22.38 189.55,19.21 189.71,19.05 IC2.13 | v165.74,25.24 158.91,25.24 158.91,21.91 157.32,20.32 155.73,20.32 155.73,16.99 153.35,14.61 R13.2
N$5  (via drill 0.41)
  Top 0.152: v188.28,20.16 187.32,20.16 183.51,23.97 v166.53,23.97 | v164.94,23.5 164.62,23.5 164.15,23.97 v155.57,23.97
  Bottom 0.152: v188.28,20.16 188.91,19.53 188.91,19.21 189.07,19.05 IC2.12 | v166.53,23.97 164.94,23.97 v164.94,23.5 | v155.57,23.97 153.19,21.59 153.19,18.41 R14.2
N$6  (via drill 0.41)
  Top 0.152: v44.13,25.24 v57.94,25.24
  Bottom 0.152: v57.94,25.24 63.02,20.16 63.02,19.68 63.18,19.53 IC3.10 | v44.13,25.24 37.31,18.41 R28.2
N$7  (via drill 0.41)
  Top 0.152: v182.09,17.94 v188.28,17.94
  Bottom 0.152: v188.28,17.94 188.28,18.73 188.44,18.89 IC2.11 | v182.09,17.94 178.75,14.61 R15.2
N$8  (via drill 0.41)
  Top 0.152: v62.39,18.41 56.99,18.41 v54.29,15.72
  Bottom 0.152: v62.39,18.41 62.39,19.21 62.55,19.37 IC3.9 | v54.29,15.72 54.29,14.61 R29.2
N$9  (via drill 0.41)
  Top 0.152: v187.64,20.8 187.32,20.8 185.42,22.7 v185.42,23.02
  Bottom 0.152: v187.64,20.8 187.64,19.21 187.8,19.05 IC2.10 | v185.42,23.02 183.04,20.64 180.97,20.64 180.97,19.84 179.55,18.41 R16.2
N$10
  Bottom 0.152: IC2.9 187.17,18.89 187.32,18.73 187.32,17.94 190.02,15.24 193.83,15.24 193.99,15.4 196.37,15.4 196.37,14.61 R17.2
N$11  (via drill 0.41)
  Top 0.152: v189.07,15.24 199.87,15.24 v200.34,15.72
  Bottom 0.152: v189.07,15.24 186.69,17.62 186.69,18.73 186.53,18.89 IC2.8 | v200.34,15.72 200.66,16.03 200.66,19.05 200.5,19.21 198.12,19.21 197.33,18.41 R18.2
N$12  (via drill 0.41)
  Top 0.152: v186.06,20 187.01,20 187.8,19.21 191.13,19.21 192.56,17.78 198.91,17.78 v199.39,17.3
  Bottom 0.152: v186.06,20 186.06,19.21 185.9,19.05 IC2.7 | v199.39,17.3 199.71,16.99 199.71,14.61 R19.2
N$13
  Bottom 0.152: R30.2 55.09,18.41 57.78,21.11 57.78,22.07 60.64,22.07 61.75,20.95 61.75,19.68 61.91,19.53 IC3.8
N$14  (via drill 0.41)
  Top 0.152: v65.25,14.61 66.2,14.61 v68.26,12.54
  Bottom 0.152: v65.25,14.61 61.44,18.41 61.44,19.21 61.28,19.37 IC3.7 | v68.26,12.54 71.91,12.54 71.91,14.61 R31.2
N$15  (via drill 0.41)
  Top 0.152: v61.12,20.64 64.93,20.64 v66.52,22.23
  Bottom 0.152: v61.12,20.64 60.8,20.32 60.8,19.68 60.64,19.53 IC3.6 | v66.52,22.23 71.6,22.23 71.6,18.73 71.91,18.41 R32.2
N$16
  Bottom 0.406: C9.1 180.97,7.46 180.97,6.03 L1.1 180.82,5.87 178.91,5.87 178.91,4.92 SERIAL.2
N$19
  Bottom 0.152: R20.2 199.55,18.41 198.75,17.62 195.74,17.62 195.58,17.78 195.58,23.5 188.75,23.5 188.44,23.18 188.44,21.91 187.01,21.91 185.42,20.32 185.42,19.21 185.26,19.05 IC2.6
N$20  (via drill 0.41)
  Top 0.152: v190.34,12.06 187.17,12.06 186.69,12.54 184.94,12.54 179.71,17.78 174.78,17.78 174.47,18.1 172.56,18.1 v170.97,16.51 | v168.75,17.78 v170.34,17.78 | v162.24,17.62 159.86,17.62 158.75,18.73 158.75,19.53 157.96,20.32 156.05,20.32 154.62,21.75 v150.34,21.75
  Bottom 0.152: v190.34,12.06 190.34,13.02 IC2.15 | v170.97,16.51 170.34,17.14 v170.34,17.78 | v168.75,17.78 168.28,17.78 167.96,17.46 162.24,17.46 v162.24,17.62 | v150.34,21.75 147.96,21.75 147.96,23.34 147.32,23.97 139.54,23.97 139.54,22.07 137.79,20.32 137.79,19.84 136.37,18.41 R12.2
N$21  (via drill 0.41)
  Top 0.152: v189.71,11.43 189.39,11.43 187.01,9.05 175.58,9.05 v175.26,9.37 | v174.78,7.94 165.26,7.94 164.94,8.26 164.31,8.26 163.19,7.14 163.19,6.67 160.66,4.13 160.18,4.13 159.07,3.02 154.94,3.02 152.88,5.08 v152.24,5.08
  Bottom 0.152: v189.71,11.43 189.71,13.02 IC2.16 | v175.26,9.37 174.78,8.89 v174.78,7.94 | v152.24,5.08 150.97,5.08 150.97,5.4 147.8,8.57 135.41,8.57 135.41,14.61 R11.2
N$22  (via drill 0.41)
  Top 0.152: v190.18,5.71 189.71,5.71 185.1,1.11 170.81,1.11 v168.75,3.17 | v162.08,6.99 154.31,6.99 154.15,6.83 152.08,6.83 151.13,7.78 131.44,7.78 129.38,9.84 129.38,10.79 v127.95,12.22
  Bottom 0.152: v190.18,5.71 190.18,6.35 189.07,7.46 189.07,13.02 IC2.17 | v168.75,3.17 168.43,3.49 168.43,4.76 166.21,6.99 v162.08,6.99 | v127.95,12.22 127.64,12.54 127.64,13.97 126.68,14.92 126.68,17.14 125.41,18.41 R10.2
N$23  (via drill 0.41)
  Top 0.152: v176.05,8.41 v186.69,8.41 | v175.1,10.64 173.35,10.64 171.93,12.06 163.04,12.06 162.24,11.27 160.97,11.27 160.5,10.79 157,10.79 156.53,11.27 155.89,11.27 v154.94,10.32 | v148.91,10.79 148.11,10.79 146.37,9.05 135.89,9.05 132.24,12.7 130.81,12.7 127.79,15.72 v126.05,15.72
  Bottom 0.152: v186.69,8.41 188.28,10 188.28,12.86 188.44,13.02 IC2.18 | v176.05,8.41 175.9,8.57 175.9,9.84 v175.1,10.64 | v154.94,10.32 152.56,12.7 152.56,13.02 152.24,13.34 150.97,13.34 150.97,12.86 v148.91,10.79 | v126.05,15.72 125.41,15.08 125.41,14.61 R9.2
N$24  (via drill 0.41)
  Top 0.152: v187.32,11.27 177.96,11.27 176.69,10 174.94,10 174.62,9.68 174.62,9.05 175.42,8.26 175.42,7.62 175.1,7.3 164.94,7.3 v164.62,7.62 | v163.19,9.05 161.29,9.05 160.97,9.37 156.84,9.37 156.53,9.05 153.51,9.05 152.08,10.48 152.08,10.64 151.29,11.43 v134.46,11.43 | v131.6,11.43 131.13,11.43 v127.48,15.08 | v126.52,18.57 124.14,18.57 121.13,21.59 v107.79,21.59
  Bottom 0.152: v187.32,11.27 187.64,11.59 187.64,12.86 187.8,13.02 IC2.19 | v163.19,9.05 v164.62,7.62 | v131.6,11.43 v134.46,11.43 | v127.48,15.08 127,15.56 127,18.1 v126.52,18.57 | v107.79,21.59 107.47,21.27 107.47,18.41 R8.2
N$25  (via drill 0.41)
  Top 0.152: v191.13,19.84 185.58,25.4 166.85,25.4 166.05,24.61 165.42,24.61 165.1,24.92 v148.27,24.92 | v132.4,26.67 131.29,26.67 130.81,26.19 126.05,26.19 v125.73,26.51
  Bottom 0.152: v191.13,19.84 191.13,17.78 193.52,17.78 193.68,17.62 194.94,17.62 198.75,13.81 198.75,11.43 193.36,11.43 191.45,13.34 191.45,13.97 187.64,13.97 187.32,13.65 187.32,13.34 187.17,13.18 IC2.20 | v148.27,24.92 147.96,24.92 147.64,24.61 146.69,24.61 146.69,25.56 146.37,25.88 133.67,25.88 133.67,26.35 133.35,26.67 v132.4,26.67 | v125.73,26.51 120.81,21.59 109.86,21.59 109.86,16.83 107.63,14.61 R7.2
N$26  (via drill 0.41)
  Top 0.152: v186.37,11.91 185.1,11.91 179.86,17.14 v178.44,17.14 | v155.89,25.56 147.96,25.56 147.64,25.88 133.83,25.88 133.19,25.24 v130.97,25.24 | v127.64,23.97 96.2,23.97 v90.96,18.73
  Bottom 0.152: v186.37,11.91 186.37,13.02 IC2.21 | v178.44,17.14 177.8,17.78 177.8,21.11 173.04,25.88 155.89,25.88 v155.89,25.56 | v130.97,25.24 128.43,25.24 128.43,24.77 v127.64,23.97 | v90.96,18.73 89.85,18.73 89.85,18.41 R6.2
N$27  (via drill 0.41)
  Top 0.152: v195.58,13.34 196.06,13.34 197.64,14.92 200.5,14.92 v201.29,15.72 | v201.29,17.3 201.29,18.26 197.8,21.75 191.13,21.75 v188.12,24.77 | v168.28,24.77 v175.1,24.77 | v165.89,22.38 164.78,22.38 164.15,21.75 161.29,21.75 160.18,22.86 157.64,22.86 156.53,21.75 155.57,21.75 v153.35,23.97 | v148.75,24.13 146.69,24.13 146.21,24.61 130.65,24.61 129.86,25.4 67.79,25.4 v67.63,25.24
  Bottom 0.152: v195.58,13.34 195.58,12.7 192.56,12.7 191.77,13.49 191.77,14.29 186.69,14.29 186.06,13.65 186.06,13.34 185.9,13.18 IC2.22 | v201.29,17.3 v201.29,15.72 | v175.1,24.77 v188.12,24.77 | v165.89,22.38 v168.28,24.77 | v153.35,23.97 148.75,23.97 v148.75,24.13 | v67.63,25.24 88.9,25.24 88.9,15.4 89.69,14.61 R5.2

### Text on the board
_bsilk: PCB-BI8-1x12SC3, v03-16 | 1